# EAGLE design radio (EAGLE 5.06)
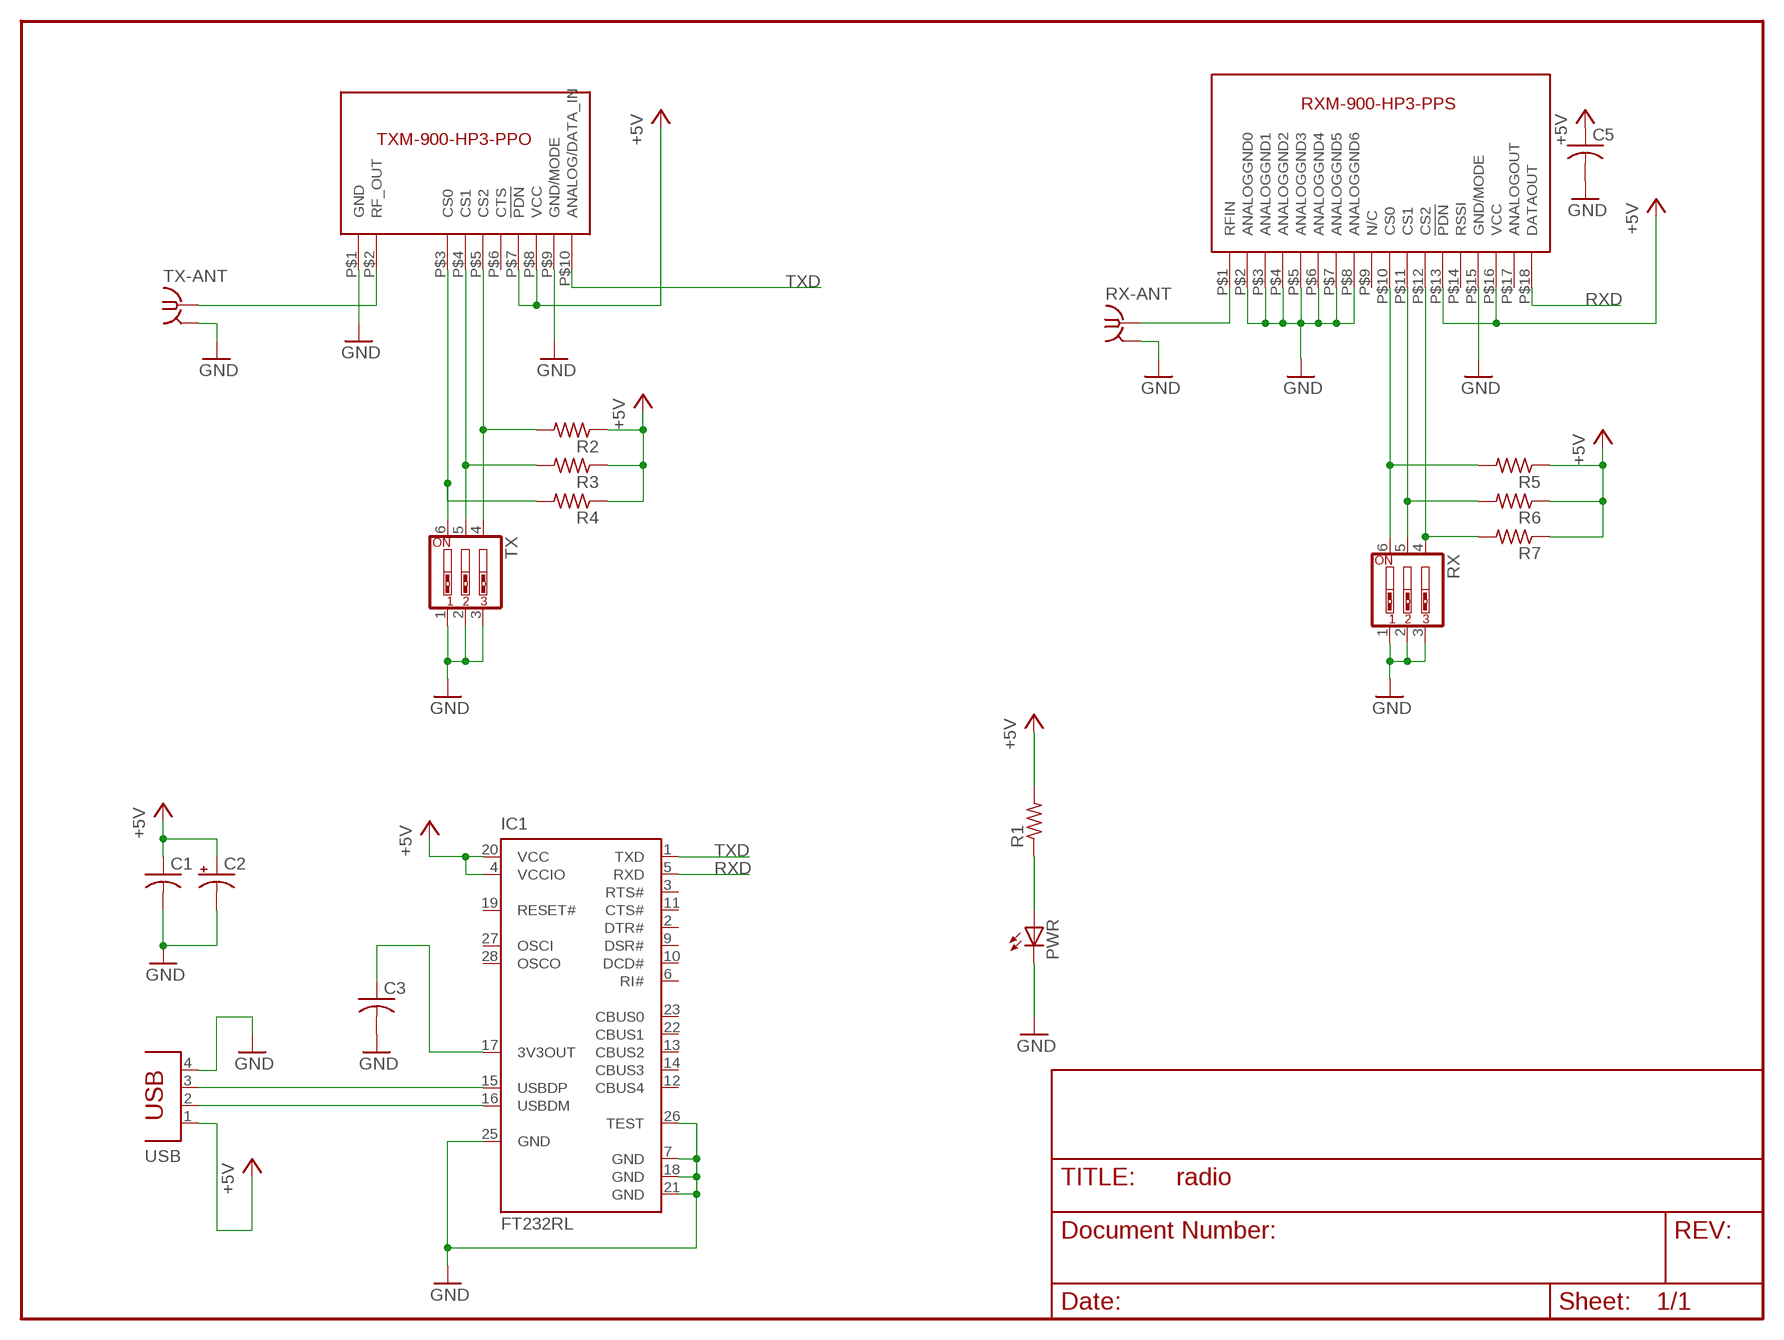
[diagram p0: schematic, sheet 1]

## Parts
C1  C-USC0805  [C0805]
C2  CPOL-USE2.5-6  [E2,5-6]
C3  C-USC0805  [C0805]
C5  C-USC0805  [C0805]
IC1  FT232RL  [SSOP28]
PWR  LEDCHIPLED_0805  [CHIPLED_0805]
R1  R-US_R0805  [R0805]
R2  R-US_R0805  [R0805]
R3  R-US_R0805  [R0805]
R4  R-US_R0805  [R0805]
R5  R-US_R0805  [R0805]
R6  R-US_R0805  [R0805]
R7  R-US_R0805  [R0805]
RX  SW_DIP-3  [EDG-03]
RX-ANT  BU-SMA-V  [BU-SMA-V]
TX  SW_DIP-3  [EDG-03]
TX-ANT  BU-SMA-V  [BU-SMA-V]
U$1  TXM-900-HP3-PPO  [SIP-10]
U$2  RX  [RX_UPRIGHT]
USB  PN61729  [PN61729]

## Nets
+5V [supply]: C1.1 C2.+ C5.1 IC1.4(VCCIO) IC1.20(VCC) R1.2 R2.1 R3.1 R4.1 R5.1 R6.1 R7.1 U$1.P$7(!PDN) U$1.P$8(VCC) U$2.P$13(!PDN) U$2.P$16(VCC) USB.1
GND [supply]: C1.2 C2.- C3.2 C5.2 IC1.7(GND) IC1.18(GND) IC1.21(GND) IC1.25(GND) IC1.26(TEST) PWR.C RX-ANT.2(GND) RX.1 RX.2 RX.3 TX-ANT.2(GND) TX.1 TX.2 TX.3 U$1.P$1(GND) U$1.P$9(GND/MODE) U$2.P$2(ANALOGGND0) U$2.P$3(ANALOGGND1) U$2.P$4(ANALOGGND2) U$2.P$5(ANALOGGND3) U$2.P$6(ANALOGGND4) U$2.P$7(ANALOGGND5) U$2.P$8(ANALOGGND6) U$2.P$15(GND/MODE) USB.4
N$5: IC1.15(USBDP) USB.3
N$6: IC1.16(USBDM) USB.2
N$10: C3.1 IC1.17(3V3OUT)
N$12: TX-ANT.1 U$1.P$2(RF_OUT)
N$13: PWR.A R1.1
N$14: RX-ANT.1 U$2.P$1(RFIN)
RXCS0: R5.2 RX.6 U$2.P$10(CS0)
RXCS1: R6.2 RX.5 U$2.P$11(CS1)
RXCS2: R7.2 RX.4 U$2.P$12(CS2)
RXD: IC1.5(RXD) U$2.P$18(DATAOUT)
TXCS0: R4.2 TX.6 U$1.P$3(CS0)
TXCS1: R3.2 TX.5 U$1.P$4(CS1)
TXCS2: R2.2 TX.4 U$1.P$5(CS2)
TXD: IC1.1(TXD) U$1.P$10(ANALOG/DATA_IN)
Unconnected: IC1.2(DTR#) IC1.3(RTS#) IC1.6(RI#) IC1.9(DSR#) IC1.10(DCD#) IC1.11(CTS#) IC1.12(CBUS4) IC1.13(CBUS2) IC1.14(CBUS3) IC1.19(RESET#) IC1.22(CBUS1) IC1.23(CBUS0) IC1.27(OSCI) IC1.28(OSCO) U$1.P$6(CTS) U$2.P$9(N/C) U$2.P$14(RSSI) U$2.P$17(ANALOGOUT)

## Power pins joined to a net without a drawn wire
GND: RX-ANT.3(GND) RX-ANT.4(GND) RX-ANT.5(GND) TX-ANT.3(GND) TX-ANT.4(GND) TX-ANT.5(GND)

## Library data of the parts
C1 C3 C5 = rcl:C-US: CAPACITOR, American symbol
C2 = rcl:CPOL-US: POLARIZED CAPACITOR, American symbol
IC1 = ftdichip:FT232R: Source: http://www.ftdichip.com/Documents/DataSheets/DS_FT232R_v104.pdf
PWR = led:LED: LED OSRAM: - CHIPLED LG R971, LG N971, LY N971, LG Q971, LY Q971, LO R971, LY R971 LH N974, LH R974 LS Q976, LO Q976, LY Q976 LO Q996 - Hyper CHIPLED LW Q18S LB Q993, LB Q99A, LB R99A - SideLED LS A670, LO A670, LY A670, LG A670, LP A670 LB A673, LV A673, LT A673, LW A673 LH A674 LY A675 LS A676, LA A676, LO A676, LY A676, LW A676 LS A679, LY A679, LG A679 - Hyper Micro SIDELED® LS Y876, LA Y876, LO Y876, LY Y876 LT Y87S - SmartLED LW L88C, LW L88S LB L89C, LB L89S, LG L890 LS L89K, LO L89K, LY L89K LS L896, LA L896, LO L896, LY L896 - TOPLED LS T670, LO T670, LY T670, LG T670, LP T670 LSG T670, LSP T670, LSY T670, LOP T670, LYG T670 LG T671, LOG T671, LSG T671 LB T673, LV T673, LT T673, LW T673 LH T674 LS T676, LA T676, LO T676, LY T676, LB T676, LH T676, LSB T676, LW T676 LB T67C, LV T67C, LT T67C, LS T67K, LO T67K, LY T67K, LW E67C LS E67B, LA E67B, LO E67B, LY E67B, LB E67C, LV E67C, LT E67C LW T67C LS T679, LY T679, LG T679 LS T770, LO T770, LY T770, LG T770, LP T770 LB T773, LV T773, LT T773, LW T773 LH T774 LS E675, LA E675, LY E675, LS T675 LS T776, LA T776, LO T776, LY T776, LB T776 LHGB T686 LT T68C, LB T68C - Hyper Mini TOPLED® LB M676 - Mini TOPLED Santana® LG M470 LS M47K, LO M47K, LY M47K Source: http://www.osram.convergy.de/
R1-R7 = rcl:R-US_: RESISTOR, American symbol
RX TX = special:SW_DIP-3: DIP SWITCH
RX-ANT TX-ANT = con-coax:BU-SMA-V: FEMALE SMA CONNECTOR Radiall distributor RS 112-3794
U$1 = linxtechnologies:TXM-900-HP3-PPO
U$2 = linxtechnologies:RX
USB = con-berg:PN61729: BERG USB connector

## Net classes
1 supply: width 0.508 mm

## Board
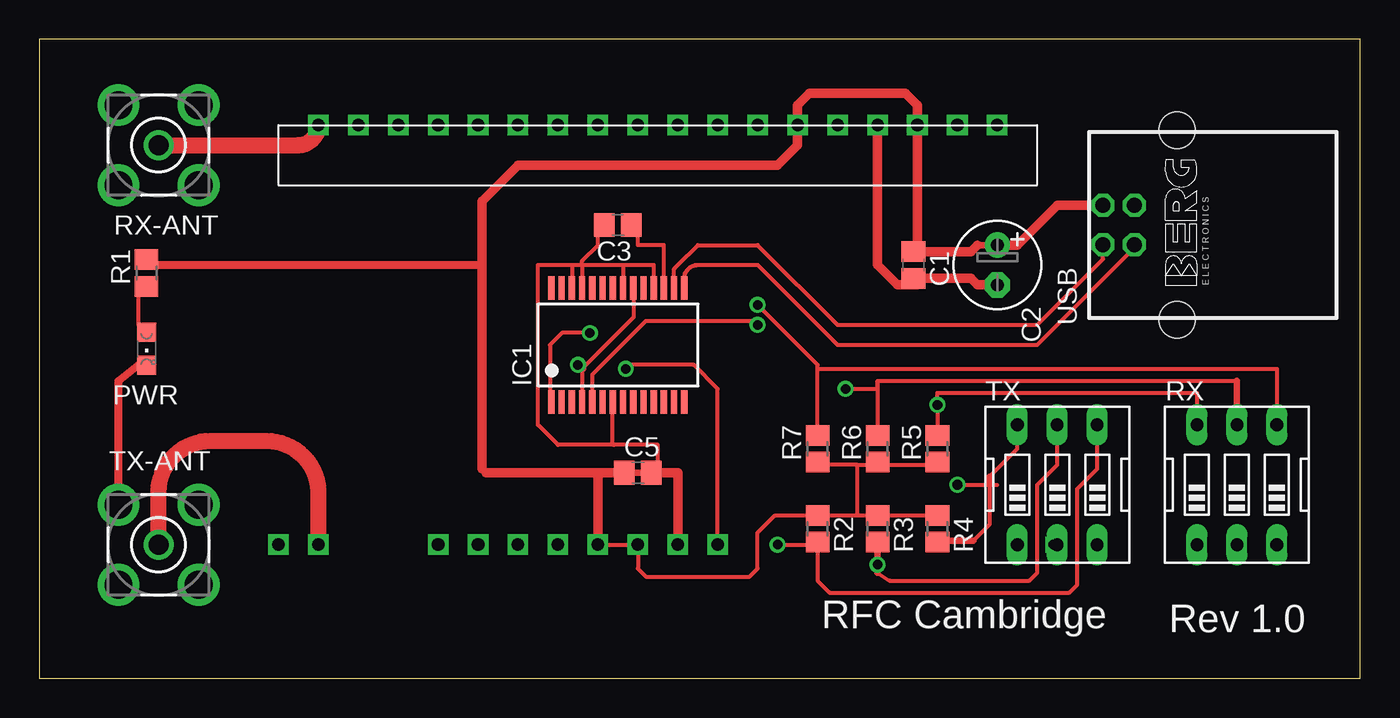
[diagram p1: board, top side]
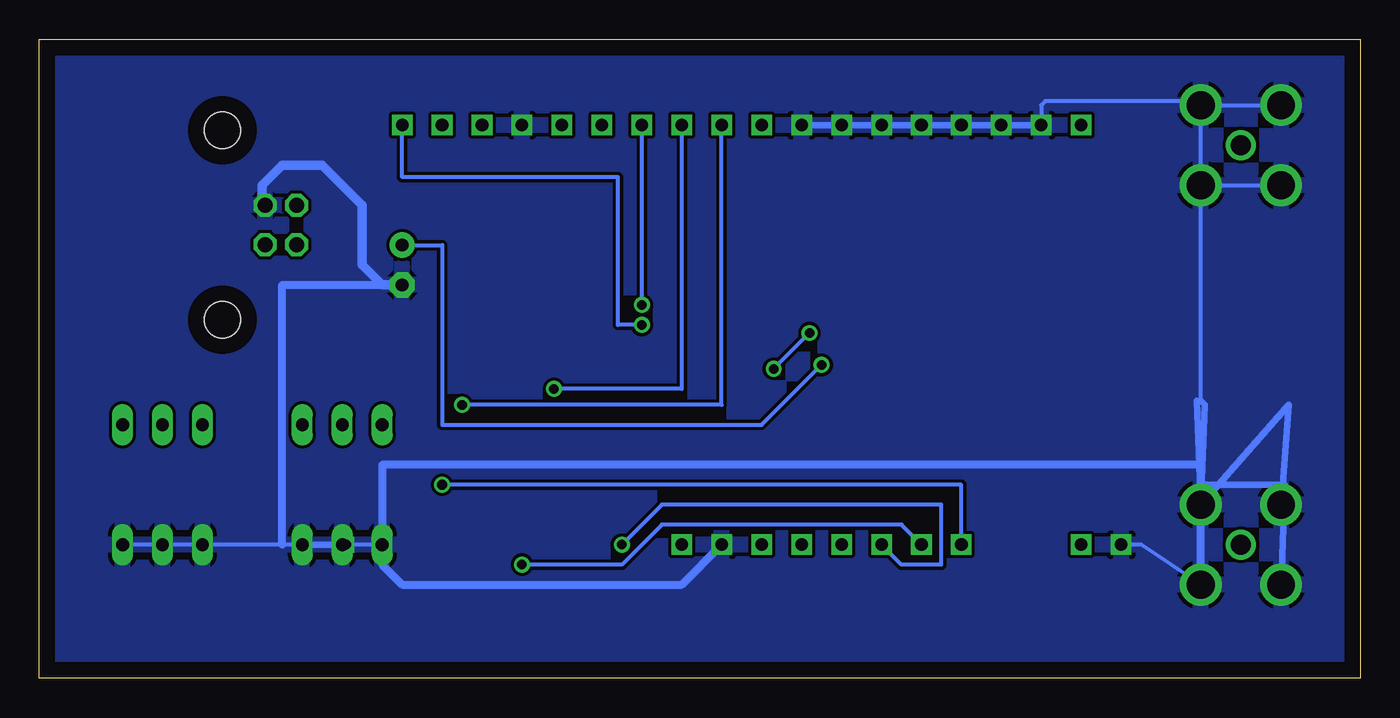
[diagram p2: board, bottom side, seen from below]

Size 84 x 40.63 mm. Coordinates in mm from the lower left corner, seen from the top.
Outline: 0,0 84,0 84,40.63 0,40.63 0,0
Copper layers (1*16): Top 0.035mm / dielectric 1.5mm / Bottom 0.035mm
Design rules "default": minimum track width 10mil, minimum drill 24mil, track to track 8mil, track to pad 8mil, pad to pad 8mil, via to via 8mil, smd to smd 8mil, copper to edge 40mil, drill to drill 8mil, minimum pad ring 10mil, minimum via ring 8mil, stop-mask expansion 4mil, vias tented up to drill 0mil, thermal gap 10mil

### Footprints (pad centres in the part's own frame; a part is rotated, then mirrored left to right if it is on the bottom)
C0805 = smd 1.3 x 1.5: 1 -0.85,0; 2 0.85,0
E2,5-6 = drill 0.813 pad 1.6 round: + -1.27,0 | drill 0.813 pad 1.6 octagon: - 1.27,0
SSOP28 = smd 0.4 x 1.5: 1 -4.225,-3.625; 2 -3.575,-3.625; 3 -2.925,-3.625; 4 -2.275,-3.625; 5 -1.625,-3.625; 6 -0.975,-3.625; 7 -0.325,-3.625; 8 0.325,-3.625; 9 0.975,-3.625; 10 1.625,-3.625; 11 2.275,-3.625; 12 2.925,-3.625; 13 3.575,-3.625; 14 4.225,-3.625; 15 4.225,3.625; 16 3.575,3.625; 17 2.925,3.625; 18 2.275,3.625; 19 1.625,3.625; 20 0.975,3.625; 21 0.325,3.625; 22 -0.325,3.625; 23 -0.975,3.625; 24 -1.625,3.625; 25 -2.275,3.625; 26 -2.925,3.625; 27 -3.575,3.625; 28 -4.225,3.625
CHIPLED_0805 = smd 1.2 x 1.2: A 0,-1.05; C 0,1.05
R0805 = smd 1.3 x 1.5: 1 -0.85,0; 2 0.85,0
EDG-03 = drill 0.813 long: 1 -2.54,-3.81; 2 0,-3.81; 3 2.54,-3.81; 4 2.54,3.81; 5 0,3.81; 6 -2.54,3.81
BU-SMA-V = drill 1.27 round: 1 0,0 | drill 1.778 round: 2 -2.55,2.55; 3 2.55,2.55; 4 2.55,-2.55; 5 -2.55,-2.55
SIP-10 = drill 0.8 square: P$1 0,0; P$2 2.54,0; P$3 10.16,0; P$4 12.7,0; P$5 15.24,0; P$6 17.78,0; P$7 20.32,0; P$8 22.86,0; P$9 25.4,0; P$10 27.94,0
RX_UPRIGHT = drill 0.8 square: P$1 2.54,0; P$2 5.08,0; P$3 7.62,0; P$4 10.16,0; P$5 12.7,0; P$6 15.24,0; P$7 17.78,0; P$8 20.32,0; P$9 22.86,0; P$10 25.4,0; P$11 27.94,0; P$12 30.48,0; P$13 33.02,0; P$14 35.56,0; P$15 38.1,0; P$16 40.64,0; P$17 43.18,0; P$18 45.72,0
PN61729 = drill 0.95 octagon: 1 1.25,4.71; 2 -1.25,4.71; 3 -1.25,2.71; 4 1.25,2.71 | hole 2.3: -6.02,0; 6.02,0

### Placement (x,y rotation side)
C1  55.59,26.28 270 top
C2  60.92,26.28 270 top
C3  36.79,28.82 180 top
C5  38.06,13.08 0 top
IC1  36.79,21.2 0 top
PWR  6.82,20.95 180 top
R1  6.82,25.78 90 top
R2  49.49,9.52 270 top
R3  53.3,9.52 270 top
R4  57.11,9.52 270 top
R5  57.11,14.6 90 top
R6  53.3,14.6 90 top
R7  49.49,14.6 90 top
RX  76.16,12.31 0 top
RX-ANT  7.58,33.9 180 top
TX  64.73,12.31 0 top
TX-ANT  7.58,8.5 90 top
U$1  15.2,8.5 0 top
U$2  15.2,35.17 0 top
USB  72.35,28.82 90 top

### Tracks (layer width: path | path; a pad name or v marks a point on that pad's centre or on a via)
+5V  (via drill 0.61)
  Top 0.254: U$1.P$7 U$1.P$8 38.06,6.98 38.57,6.47 45.17,6.47 45.68,6.98 45.68,9.27 46.79,10.37 R2.1 52.03,10.37 | 28.16,13.33 28.41,13.08 | 48.22,34.92 47.97,35.17 | R3.1 R4.1 | 52.03,10.37 53.21,10.37 | 52.03,13.58 53.3,13.58 57.11,13.58 | 52.03,13.58 49.49,13.58 | 52.03,10.37 52.03,13.58 | IC1.4 34.52,19.69 37.81,22.98 37.81,24.76 37.77,24.8 IC1.20
  Top 0.406: 67.27,30.09 67.29,30.07 | C1.1 55.84,27.13 55.84,27.05 | 59.65,27.55 C2.+ | 47.97,35.17 U$2.P$13 | 53.05,10.28 53.14,10.37 R3.1 53.3,10.28 53.21,10.37
  Top 0.508: 49.49,13.58 R7.1 | 57.11,13.58 R5.1 | 53.3,13.58 R6.1 | v34.25,19.93 34.52,19.69 | 55.84,27.55 C1.1 | R1.2 6.31,26.28 28.16,26.28
  Top 0.61: C2.+ 62.19,27.55 64.73,30.09 67.27,30.09 | 67.29,30.07 USB.1 | 55.84,27.13 59.23,27.13 59.65,27.55 | U$2.P$13 48.22,36.44 48.98,37.21 55.08,37.21 55.84,36.44 U$2.P$16 55.84,27.55 | 35.52,13.08 U$1.P$7 | 28.41,13.08 35.52,13.08 | 28.16,13.33 28.16,26.28 28.16,30.35 30.44,32.63 46.95,32.63 48.22,33.9 48.22,34.92 | 35.52,13.08 C5.1
  Bottom 0.254: v34.25,19.93 38.06,16.12 58.38,16.12 58.38,27.55 C2.+
GND  (via drill 0.6)
  Top 0.254: 34.52,26.28 IC1.25 | 34.52,26.28 34.52,26.55 35.52,27.55 35.52,28.82 C3.2 | 33.87,26.28 IC1.26 | IC1.18 39.07,26.28 37.12,26.28 | 37.12,26.28 IC1.21 | 34.51,26.28 34.52,26.28 | 34.51,26.28 37.12,26.28 | 33.87,26.28 31.71,26.28 31.71,16.12 32.98,14.85 36.54,14.85 | 36.54,14.85 39.33,14.85 39.33,13.58 | 33.87,26.28 34.51,26.28 | IC1.7 36.47,14.93 36.54,14.85
  Top 0.406: 39.33,13.08 C5.2 37.81,13.08 | TX.2 64.73,8.25 v64.48,8.5 | RX.1 73.62,8.25 73.37,8.5 | RX.2 76.42,8.5 | RX.3 78.96,8.25
  Top 0.508: 39.33,13.08 39.33,13.58 C5.2 | C1.2 55.84,25.01 | PWR.C 6.31,19.93 5.04,18.92 5.04,12.31 TX-ANT.3
  Top 0.61: C1.2 59.23,25.43 59.65,25.01 C2.- | U$1.P$9 40.6,13.08 39.33,13.08 | U$2.P$15 53.3,26.28 54.57,25.01 55.84,25.01
  Bottom 0.254: 69.79,30.07 USB.4 | TX.1 v64.48,8.5 | RX.3 RX.2 RX.1 68.54,8.5 TX.3 | U$1.P$1 13.93,8.5 TX-ANT.5 | 10.11,31.35 RX-ANT.3 | 10.13,36.43 RX-ANT.2 10.13,17.66 | RX-ANT.5 4.8,36.45 | U$2.P$2 20.28,36.44 20.03,36.7 10.38,36.7
  Bottom 0.406: 69.81,30.09 69.79,30.07 | TX.2 TX.3 | U$2.P$2 U$2.P$3 U$2.P$4 U$2.P$5 U$2.P$6 U$2.P$7 U$2.P$8 35.78,35.17 | TX-ANT.5 10.12,12.31 | TX-ANT.5 TX-ANT.4 | TX-ANT.4 10.38,17.65 | 4.54,17.4 TX-ANT.3 | TX-ANT.4 4.54,17.4 | 4.54,17.4 4.53,17.39 | TX-ANT.2 4.8,12.3 4.79,12.31 9.87,12.31 10.12,12.57 10.13,12.56 TX-ANT.5 | RX-ANT.2 10.11,31.35 | 10.11,36.45 9.87,36.7 | 10.11,36.45 RX-ANT.5 | 10.13,36.43 RX-ANT.5 | RX-ANT.5 10.11,36.45 | RX-ANT.4 4.8,36.45 4.79,36.44 | 9.88,17.4 9.87,17.39 | TX-ANT.4 9.88,17.4 | 9.88,17.4 10.13,17.66 | RX-ANT.5 10.38,36.7
  Bottom 0.508: U$1.P$9 43.14,5.96 60.92,5.96 62.19,7.23 TX.1 62.19,13.58 10.12,13.58 TX-ANT.5 | 68.54,8.5 68.54,25.01 62.19,25.01
  Bottom 0.61: C2.- 62.19,25.01 63.46,26.28 63.46,30.09 66,32.63 68.54,32.63 69.81,31.36 69.81,30.09
  pour Bottom: -2.32,-1.15 -2.32,42.03 86.83,42.03 86.83,-1.15
N$5
  Top 0.254: USB.3 69.64,27.38 63.46,21.2 50.76,21.2 45.68,26.28 41.87,26.28 arc90 41.02,25.43 IC1.15
N$6
  Top 0.254: USB.2 67.64,26.65 63.46,22.47 50.76,22.47 45.68,27.55 41.87,27.55 40.6,26.28 40.37,26.03 IC1.16
N$10
  Top 0.254: IC1.17 39.72,27.55 38.06,27.55 38.06,28.82 C3.1
N$12
  Top 1.016: TX-ANT.1 7.58,11.81 arc-90 10.88,15.11 14.44,15.11 arc-90 17.74,11.81 U$1.P$2
N$13
  Top 0.254: PWR.A 6.31,22.47 6.31,25.01 R1.1
N$14
  Top 1.016: RX-ANT.1 16.47,33.9 arc90 U$2.P$1
RXCS0  (via drill 0.61)
  Top 0.254: R5.2 v57.11,17.39 57.11,18.16 73.62,18.16 RX.6
  Bottom 0.254: U$2.P$10 40.6,17.39 v57.11,17.39
RXCS1  (via drill 0.6)
  Top 0.254: 53.3,18.92 R6.2 | 53.3,18.92 76.16,18.92 | 53.3,18.92 53.3,18.41 v51.27,18.41
  Top 0.406: 76.16,18.92 RX.5
  Bottom 0.254: v51.27,18.41 43.14,18.41 U$2.P$11
RXCS2  (via drill 0.61)
  Top 0.254: RX.4 78.7,19.68 49.49,19.68 | R7.2 49.49,19.68 | v45.68,23.74 49.49,19.93 49.49,19.68
  Bottom 0.254: v45.68,23.74 U$2.P$12
RXD  (via drill 0.61)
  Top 0.254: IC1.5 35.17,19.32 38.57,22.73 45.43,22.73 v45.68,22.47
  Bottom 0.254: v45.68,22.47 47.21,22.47 47.21,31.87 60.92,31.87 U$2.P$18
TXCS0  (via drill 0.61)
  Top 0.254: TX.6 62.19,14.6 60.41,12.82 | 60.41,12.31 60.41,9.77 59.4,8.76 | v58.38,12.31 60.41,12.31 | 60.41,12.31 60.92,12.31
  Top 0.406: 60.41,12.31 60.41,12.82 | R4.2 57.11,8.5 57.37,8.76 59.4,8.76
  Bottom 0.254: U$1.P$3 25.36,12.31 v58.38,12.31
TXCS1  (via drill 0.61)
  Top 0.254: TX.5 64.73,13.58 63.46,12.31 63.46,6.73 62.95,6.22 54.06,6.22 53.3,6.73
  Top 0.406: 53.47,8.67 53.56,8.76 | 53.47,8.67 R3.2 | 53.3,6.73 v53.3,7.23 53.3,8.5 53.47,8.67
  Bottom 0.254: U$1.P$4 29.17,9.77 44.41,9.77 46.95,7.23 v53.3,7.23
TXCS2  (via drill 0.61)
  Top 0.254: TX.4 67.27,13.33 66,12.06 66,5.96 65.49,5.46 50.25,5.46 49.49,6.22 49.49,8.5 v46.95,8.5
  Top 0.406: 49.49,8.5 R2.2
  Bottom 0.254: U$1.P$5 29.17,7.23 26.63,7.23 26.63,11.04 44.41,11.04 v46.95,8.5
TXD  (via drill 0.6)
  Top 0.254: U$1.P$10 43.14,18.41 41.62,19.93 37.55,19.93 v37.3,19.68 | v35.01,21.97 33.24,21.97 32.47,21.2 32.47,17.39 32.57,17.49 IC1.1
  Bottom 0.254: v37.3,19.68 v35.01,21.97

### Text on the board
tPlace: RFC Cambridge | Rev 1.0